# EAGLE schematic FamicomBox+ (EAGLE 9.6.2)
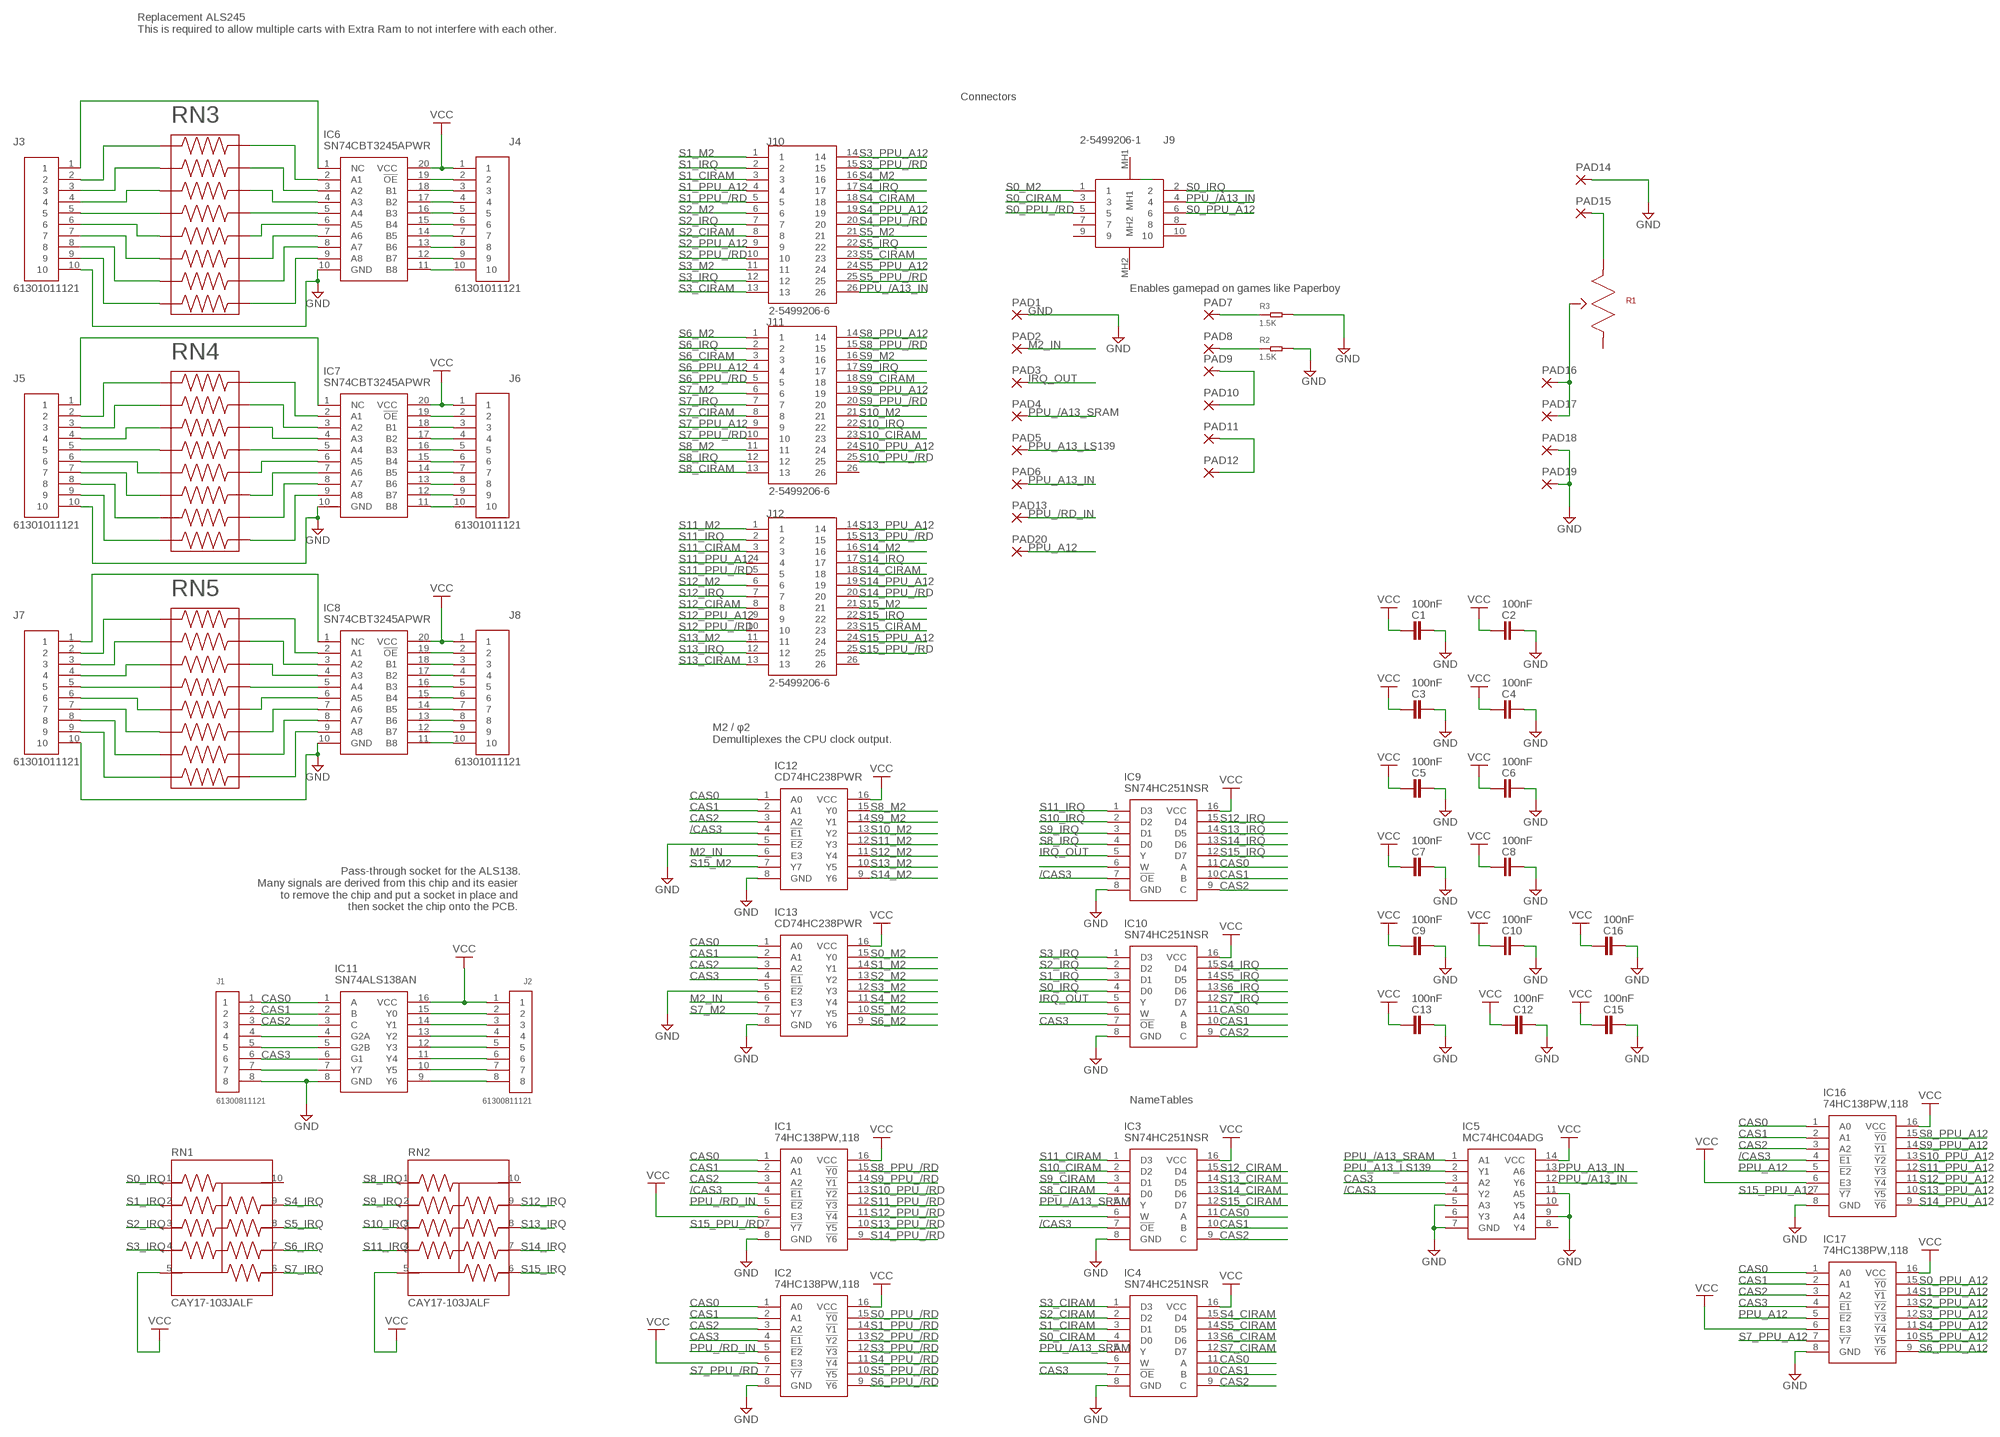
[diagram p0: schematic, sheet 1]

## Parts
C1  100nF  C_CHIP-0603(1608-METRIC)  [CAPC1608X85]
C2  100nF  C_CHIP-0603(1608-METRIC)  [CAPC1608X85]
C3  100nF  C_CHIP-0603(1608-METRIC)  [CAPC1608X85]
C4  100nF  C_CHIP-0603(1608-METRIC)  [CAPC1608X85]
C5  100nF  C_CHIP-0603(1608-METRIC)  [CAPC1608X85]
C6  100nF  C_CHIP-0603(1608-METRIC)  [CAPC1608X85]
C7  100nF  C_CHIP-0603(1608-METRIC)  [CAPC1608X85]
C8  100nF  C_CHIP-0603(1608-METRIC)  [CAPC1608X85]
C9  100nF  C_CHIP-0603(1608-METRIC)  [CAPC1608X85]
C10  100nF  C_CHIP-0603(1608-METRIC)  [CAPC1608X85]
C12  100nF  C_CHIP-0603(1608-METRIC)  [CAPC1608X85]
C13  100nF  C_CHIP-0603(1608-METRIC)  [CAPC1608X85]
C15  100nF  C_CHIP-0603(1608-METRIC)  [CAPC1608X85]
C16  100nF  C_CHIP-0603(1608-METRIC)  [CAPC1608X85]
IC1  74HC138PW,118  [SOP65P640X110-16N]
IC2  74HC138PW,118  [SOP65P640X110-16N]
IC3  SN74HC251NSR  [SOIC127P780X200-16N]
IC4  SN74HC251NSR  [SOIC127P780X200-16N]
IC5  MC74HC04ADG  [SOIC127P600X175-14N]
IC6  SN74CBT3245APWR  [SOP65P640X120-20N]
IC7  SN74CBT3245APWR  [SOP65P640X120-20N]
IC8  SN74CBT3245APWR  [SOP65P640X120-20N]
IC9  SN74HC251NSR  [SOIC127P780X200-16N]
IC10  SN74HC251NSR  [SOIC127P780X200-16N]
IC11  SN74ALS138AN  [DIP254P762X508-16]
IC12  CD74HC238PWR  [SOP65P640X120-16N]
IC13  CD74HC238PWR  [SOP65P640X120-16N]
IC16  74HC138PW,118  [SOP65P640X110-16N]
IC17  74HC138PW,118  [SOP65P640X110-16N]
J1  61300811121  [61300811121]
J2  61300811121  [61300811121]
J3  61301011121  [61301011121]
J4  61301011121  [61301011121]
J5  61301011121  [61301011121]
J6  61301011121  [61301011121]
J7  61301011121  [61301011121]
J8  61301011121  [61301011121]
J9  2-5499206-1  [254992061]
J10  2-5499206-6  [TE_2-5499206-6]
J11  2-5499206-6  [TE_2-5499206-6]
J12  2-5499206-6  [TE_2-5499206-6]
PAD1  WIREPAD2,54/1,0  [2,54/1,0]
PAD2  WIREPAD2,54/1,0  [2,54/1,0]
PAD3  WIREPAD2,54/1,0  [2,54/1,0]
PAD4  WIREPAD2,54/1,0  [2,54/1,0]
PAD5  WIREPAD2,54/1,0  [2,54/1,0]
PAD6  WIREPAD2,54/1,0  [2,54/1,0]
PAD7  WIREPAD2,54/1,0  [2,54/1,0]
PAD8  WIREPAD2,54/1,0  [2,54/1,0]
PAD9  WIREPAD2,54/1,0  [2,54/1,0]
PAD10  WIREPAD2,54/1,0  [2,54/1,0]
PAD11  WIREPAD2,54/1,0  [2,54/1,0]
PAD12  WIREPAD2,54/1,0  [2,54/1,0]
PAD13  WIREPAD2,54/1,0  [2,54/1,0]
PAD14  WIREPAD2,54/1,0  [2,54/1,0]
PAD15  WIREPAD2,54/1,0  [2,54/1,0]
PAD16  WIREPAD2,54/1,0  [2,54/1,0]
PAD17  WIREPAD2,54/1,0  [2,54/1,0]
PAD18  WIREPAD2,54/1,0  [2,54/1,0]
PAD19  WIREPAD2,54/1,0  [2,54/1,0]
PAD20  WIREPAD2,54/1,0  [2,54/1,0]
R1  PTV09A-4020F-A504  [PTV09]
R2  1.5K  SMD-RES-1.2K-1%-1/10W(0603)  [R0603]
R3  1.5K  SMD-RES-1.2K-1%-1/10W(0603)  [R0603]
RN1  CAY17-103JALF  [RESCAXS64P320X160X60-10N]
RN2  CAY17-103JALF  [RESCAXS64P320X160X60-10N]
RN3  4816P-1-562LF  [SOIC127P762X240-16N]
RN4  4816P-1-562LF  [SOIC127P762X240-16N]
RN5  4816P-1-562LF  [SOIC127P762X240-16N]

## Nets
/CAS3: IC1.4(!E1) IC3.7(!OE) IC5.4(Y2) IC9.7(!OE) IC12.4(!E1) IC16.4(!E1)
CAS0: IC1.1(A0) IC2.1(A0) IC3.11(A) IC4.11(A) IC9.11(A) IC10.11(A) IC11.1(A) IC12.1(A0) IC13.1(A0) IC16.1(A0) IC17.1(A0) J1.1
CAS1: IC1.2(A1) IC2.2(A1) IC3.10(B) IC4.10(B) IC9.10(B) IC10.10(B) IC11.2(B) IC12.2(A1) IC13.2(A1) IC16.2(A1) IC17.2(A1) J1.2
CAS2: IC1.3(A2) IC2.3(A2) IC3.9(C) IC4.9(C) IC9.9(C) IC10.9(C) IC11.3(C) IC12.3(A2) IC13.3(A2) IC16.3(A2) IC17.3(A2) J1.3
CAS3: IC2.4(!E1) IC4.7(!OE) IC5.3(A2) IC10.7(!OE) IC11.6(G1) IC13.4(!E1) IC17.4(!E1) J1.6
GND: C1.1 C2.1 C3.1 C4.1 C5.1 C6.1 C7.1 C8.1 C9.1 C10.1 C12.1 C13.1 C15.1 C16.1 IC1.8(GND) IC2.8(GND) IC3.8(GND) IC4.8(GND) IC5.5(A3) IC5.7(GND) IC5.9(A4) IC5.11(A5) IC6.10(GND) IC7.10(GND) IC8.10(GND) IC9.8(GND) IC10.8(GND) IC11.8(GND) IC12.5(!E2) IC12.8(GND) IC13.5(!E2) IC13.8(GND) IC16.8(GND) IC17.8(GND) J1.8 J3.10 J5.10 J7.10 PAD1.1(P) PAD14.1(P) PAD18.1(P) PAD19.1(P) R2.2 R3.2
IRQ_OUT: IC9.5(Y) IC10.5(Y) PAD3.1(P)
M2_IN: IC12.6(E3) IC13.6(E3) PAD2.1(P)
N$1: IC6.2(A1) RN3.16
N$2: IC6.3(A2) RN3.15
N$3: IC6.4(A3) RN3.14
N$4: IC6.5(A4) RN3.13
N$5: IC6.6(A5) RN3.12
N$6: IC6.7(A6) RN3.11
N$7: IC6.8(A7) RN3.10
N$8: IC6.9(A8) RN3.9
N$9: J3.2 RN3.1
N$10: J3.3 RN3.2
N$11: IC6.11(B8) J4.10
N$12: IC6.12(B7) J4.9
N$13: IC6.13(B6) J4.8
N$14: IC6.14(B5) J4.7
N$15: IC6.15(B4) J4.6
N$16: IC6.16(B3) J4.5
N$17: IC6.17(B2) J4.4
N$18: IC6.18(B1) J4.3
N$19: IC6.19(!OE) J4.2
N$20: J3.4 RN3.3
N$21: J3.5 RN3.4
N$22: J3.6 RN3.5
N$23: J3.7 RN3.6
N$24: J3.8 RN3.7
N$25: J3.9 RN3.8
N$26: IC6.1(NC) J3.1
N$27: J7.2 RN5.1
N$29: IC7.11(B8) J6.10
N$30: IC7.12(B7) J6.9
N$31: IC7.13(B6) J6.8
N$32: IC7.14(B5) J6.7
N$33: IC7.15(B4) J6.6
N$34: IC7.16(B3) J6.5
N$35: IC7.17(B2) J6.4
N$36: IC7.18(B1) J6.3
N$37: IC7.19(!OE) J6.2
N$38: IC8.19(!OE) J8.2
N$39: IC8.18(B1) J8.3
N$40: IC8.17(B2) J8.4
N$41: IC8.16(B3) J8.5
N$42: IC8.15(B4) J8.6
N$43: IC8.14(B5) J8.7
N$44: IC8.13(B6) J8.8
N$45: IC8.12(B7) J8.9
N$46: IC8.11(B8) J8.10
N$47: IC7.5(A4) RN4.13
N$48: J5.5 RN4.4
N$49: J5.2 RN4.1
N$50: J5.3 RN4.2
N$51: J5.4 RN4.3
N$52: J5.6 RN4.5
N$53: J5.7 RN4.6
N$54: J5.8 RN4.7
N$55: J5.9 RN4.8
N$56: IC11.15(Y0) J2.2
N$57: IC11.14(Y1) J2.3
N$58: IC11.13(Y2) J2.4
N$59: IC11.12(Y3) J2.5
N$60: IC11.11(Y4) J2.6
N$61: IC11.10(Y5) J2.7
N$62: IC11.9(Y6) J2.8
N$63: IC11.4(G2A) J1.4
N$64: PAD9.1(P) PAD10.1(P)
N$65: PAD11.1(P) PAD12.1(P)
N$66: IC7.4(A3) RN4.14
N$67: IC11.5(G2B) J1.5
N$68: IC7.3(A2) RN4.15
N$69: IC11.7(Y7) J1.7
N$70: IC9.6(W)
N$71: IC7.2(A1) RN4.16
N$72: IC7.1(NC) J5.1
N$73: IC7.6(A5) RN4.12
N$74: IC7.7(A6) RN4.11
N$75: IC7.8(A7) RN4.10
N$76: IC7.9(A8) RN4.9
N$77: J7.3 RN5.2
N$78: J7.5 RN5.4
N$79: IC8.5(A4) RN5.13
N$80: IC8.4(A3) RN5.14
N$81: IC8.3(A2) RN5.15
N$82: IC8.2(A1) RN5.16
N$83: IC8.6(A5) RN5.12
N$84: IC8.7(A6) RN5.11
N$85: IC8.8(A7) RN5.10
N$86: IC10.6(W)
N$87: IC8.9(A8) RN5.9
N$88: IC8.1(NC) J7.1
N$89: J7.4 RN5.3
N$90: J7.6 RN5.5
N$91: J7.7 RN5.6
N$92: J7.8 RN5.7
N$93: J7.9 RN5.8
N$94: PAD15.1(P) R1.1
N$95: PAD16.1(P) PAD17.1(P) R1.2
N$96: PAD8.1(P) R2.1
N$97: PAD7.1(P) R3.1
N$108: IC3.6(W)
N$122: IC4.6(W)
PPU_/A13_IN: IC5.12(Y6) J9.4 J10.26
PPU_/A13_SRAM: IC3.5(Y) IC4.5(Y) IC5.1(A1) PAD4.1(P)
PPU_/RD_IN: IC1.5(!E2) IC2.5(!E2) PAD13.1(P)
PPU_A12: IC16.5(!E2) IC17.5(!E2) PAD20.1(P)
PPU_A13_IN: IC5.13(A6) PAD6.1(P)
PPU_A13_LS139: IC5.2(Y1) PAD5.1(P)
S0_CIRAM: IC4.4(D0) J9.3
S0_IRQ: IC10.4(D0) J9.2 RN1.1
S0_M2: IC13.15(Y0) J9.1
S0_PPU_/RD: IC2.15(!Y0) J9.5
S0_PPU_A12: IC17.15(!Y0) J9.6
S1_CIRAM: IC4.3(D1) J10.3
S1_IRQ: IC10.3(D1) J10.2 RN1.2
S1_M2: IC13.14(Y1) J10.1
S1_PPU_/RD: IC2.14(!Y1) J10.5
S1_PPU_A12: IC17.14(!Y1) J10.4
S2_CIRAM: IC4.2(D2) J10.8
S2_IRQ: IC10.2(D2) J10.7 RN1.3
S2_M2: IC13.13(Y2) J10.6
S2_PPU_/RD: IC2.13(!Y2) J10.10
S2_PPU_A12: IC17.13(!Y2) J10.9
S3_CIRAM: IC4.1(D3) J10.13
S3_IRQ: IC10.1(D3) J10.12 RN1.4
S3_M2: IC13.12(Y3) J10.11
S3_PPU_/RD: IC2.12(!Y3) J10.15
S3_PPU_A12: IC17.12(!Y3) J10.14
S4_CIRAM: IC4.15(D4) J10.18
S4_IRQ: IC10.15(D4) J10.17 RN1.9
S4_M2: IC13.11(Y4) J10.16
S4_PPU_/RD: IC2.11(!Y4) J10.20
S4_PPU_A12: IC17.11(!Y4) J10.19
S5_CIRAM: IC4.14(D5) J10.23
S5_IRQ: IC10.14(D5) J10.22 RN1.8
S5_M2: IC13.10(Y5) J10.21
S5_PPU_/RD: IC2.10(!Y5) J10.25
S5_PPU_A12: IC17.10(!Y5) J10.24
S6_CIRAM: IC4.13(D6) J11.3
S6_IRQ: IC10.13(D6) J11.2 RN1.7
S6_M2: IC13.9(Y6) J11.1
S6_PPU_/RD: IC2.9(!Y6) J11.5
S6_PPU_A12: IC17.9(!Y6) J11.4
S7_CIRAM: IC4.12(D7) J11.8
S7_IRQ: IC10.12(D7) J11.7 RN1.6
S7_M2: IC13.7(Y7) J11.6
S7_PPU_/RD: IC2.7(!Y7) J11.10
S7_PPU_A12: IC17.7(!Y7) J11.9
S8_CIRAM: IC3.4(D0) J11.13
S8_IRQ: IC9.4(D0) J11.12 RN2.1
S8_M2: IC12.15(Y0) J11.11
S8_PPU_/RD: IC1.15(!Y0) J11.15
S8_PPU_A12: IC16.15(!Y0) J11.14
S9_CIRAM: IC3.3(D1) J11.18
S9_IRQ: IC9.3(D1) J11.17 RN2.2
S9_M2: IC12.14(Y1) J11.16
S9_PPU_/RD: IC1.14(!Y1) J11.20
S9_PPU_A12: IC16.14(!Y1) J11.19
S10_CIRAM: IC3.2(D2) J11.23
S10_IRQ: IC9.2(D2) J11.22 RN2.3
S10_M2: IC12.13(Y2) J11.21
S10_PPU_/RD: IC1.13(!Y2) J11.25
S10_PPU_A12: IC16.13(!Y2) J11.24
S11_CIRAM: IC3.1(D3) J12.3
S11_IRQ: IC9.1(D3) J12.2 RN2.4
S11_M2: IC12.12(Y3) J12.1
S11_PPU_/RD: IC1.12(!Y3) J12.5
S11_PPU_A12: IC16.12(!Y3) J12.4
S12_CIRAM: IC3.15(D4) J12.8
S12_IRQ: IC9.15(D4) J12.7 RN2.9
S12_M2: IC12.11(Y4) J12.6
S12_PPU_/RD: IC1.11(!Y4) J12.10
S12_PPU_A12: IC16.11(!Y4) J12.9
S13_CIRAM: IC3.14(D5) J12.13
S13_IRQ: IC9.14(D5) J12.12 RN2.8
S13_M2: IC12.10(Y5) J12.11
S13_PPU_/RD: IC1.10(!Y5) J12.15
S13_PPU_A12: IC16.10(!Y5) J12.14
S14_CIRAM: IC3.13(D6) J12.18
S14_IRQ: IC9.13(D6) J12.17 RN2.7
S14_M2: IC12.9(Y6) J12.16
S14_PPU_/RD: IC1.9(!Y6) J12.20
S14_PPU_A12: IC16.9(!Y6) J12.19
S15_CIRAM: IC3.12(D7) J12.23
S15_IRQ: IC9.12(D7) J12.22 RN2.6
S15_M2: IC12.7(Y7) J12.21
S15_PPU_/RD: IC1.7(!Y7) J12.25
S15_PPU_A12: IC16.7(!Y7) J12.24
VCC: C1.2 C2.2 C3.2 C4.2 C5.2 C6.2 C7.2 C8.2 C9.2 C10.2 C12.2 C13.2 C15.2 C16.2 IC1.6(E3) IC1.16(VCC) IC2.6(E3) IC2.16(VCC) IC3.16(VCC) IC4.16(VCC) IC5.14(VCC) IC6.20(VCC) IC7.20(VCC) IC8.20(VCC) IC9.16(VCC) IC10.16(VCC) IC11.16(VCC) IC12.16(VCC) IC13.16(VCC) IC16.6(E3) IC16.16(VCC) IC17.6(E3) IC17.16(VCC) J2.1 J4.1 J6.1 J8.1 RN1.5 RN2.5
Unconnected: IC5.6(Y3) IC5.8(Y4) IC5.10(Y5) J9.7 J9.8 J9.9 J9.10 J9.MH1 J9.MH2 J11.26 J12.26 R1.3 RN1.10 RN2.10

## Notes on the sheet
- Replacement ALS245
  This is required to allow multiple carts with Extra Ram to not interfere with each other.
- Connectors
- Enables gamepad on games like Paperboy
- M2 / φ2
  Demultiplexes the CPU clock output.
- Pass-through socket for the ALS138.
  Many signals are derived from this chip and its easier 
  to remove the chip and put a socket in place and 
  then socket the chip onto the PCB.
- NameTables

## Library data of the parts
C1-C10 C12 C13 C15 C16 = Capacitor:C: Capacitor - Generic; CATEGORY: Capacitor
IC1 IC2 IC16 IC17 = 74HC138PW_118:74HC138PW,118: 74HC(T)138 - 3-to-8 line decoder/demultiplexer; inverting@en-us Source: Datasheet <https://assets.nexperia.com/documents/data-sheet/74HC_HCT138.pdf>; ARROW_PART_NUMBER: 74HC138PW,118; ARROW_PRICE-STOCK: https://www.arrow.com/en/products/74hc138pw118/nexperia; DESCRIPTION: 74HC(T)138 - 3-to-8 line decoder/demultiplexer; inverting@en-us; HEIGHT: 1.1mm; MANUFACTURER_NAME: Nexperia; MANUFACTURER_PART_NUMBER: 74HC138PW,118; MOUSER_PART_NUMBER: 771-74HC138PW-T; MOUSER_PRICE-STOCK: https://www.mouser.co.uk/ProductDetail/Nexperia/74HC138PW118?qs=P62ublwmbi97Yb8SK4wHOw%3D%3D
IC3 IC4 IC9 IC10 = SN74HC251NSR:SN74HC251NSR: Data Selectors/Multiplexers With 3-State Outputs Source: Datasheet <http://www.ti.com/lit/gpn/sn74hc251>; ARROW_PART_NUMBER: SN74HC251NSR; ARROW_PRICE-STOCK: https://www.arrow.com/en/products/sn74hc251nsr/texas-instruments; DESCRIPTION: Data Selectors/Multiplexers With 3-State Outputs; HEIGHT: 2mm; MANUFACTURER_NAME: Texas Instruments; MANUFACTURER_PART_NUMBER: SN74HC251NSR; MOUSER_PART_NUMBER: 595-SN74HC251NSR; MOUSER_PRICE-STOCK: https://www.mouser.co.uk/ProductDetail/Texas-Instruments/SN74HC251NSR?qs=3FVjRv9mUZ%252BV3BPq6pq0uQ%3D%3D
IC5 = MC74HC04ADG:MC74HC04ADG: ON SEMICONDUCTOR - MC74HC04ADG - IC, 74HC CMOS, SMD, 74HC04, SOIC14 Source: Datasheet <https://www.onsemi.com/pub/Collateral/MC74HC04A-D.PDF>; ARROW_PART_NUMBER: MC74HC04ADG; ARROW_PRICE-STOCK: https://www.arrow.com/en/products/mc74hc04adg/on-semiconductor; DESCRIPTION: ON SEMICONDUCTOR - MC74HC04ADG - IC, 74HC CMOS, SMD, 74HC04, SOIC14; HEIGHT: 1.75mm; MANUFACTURER_NAME: ON Semiconductor; MANUFACTURER_PART_NUMBER: MC74HC04ADG; MOUSER_PART_NUMBER: 863-MC74HC04ADG; MOUSER_PRICE-STOCK: https://www.mouser.co.uk/ProductDetail/ON-Semiconductor/MC74HC04ADG?qs=qg33o%252B8vzFrk%2Fs2XGCpy6A%3D%3D
IC6-IC8 = SN74CBT3245APWR:SN74CBT3245APWR: OCTAL BUS TRANSCEIVER WITH 3-STATE OUTPUTS Source: Datasheet <http://www.ti.com/lit/gpn/sn74cbt3245a>; ARROW_PART_NUMBER: SN74CBT3245APWR; ARROW_PRICE-STOCK: https://www.arrow.com/en/products/sn74cbt3245apwr/texas-instruments; DESCRIPTION: OCTAL BUS TRANSCEIVER WITH 3-STATE OUTPUTS; HEIGHT: 1.2mm; MANUFACTURER_NAME: Texas Instruments; MANUFACTURER_PART_NUMBER: SN74CBT3245APWR; MOUSER_PART_NUMBER: 595-SN74CBT3245APWR; MOUSER_PRICE-STOCK: https://www.mouser.co.uk/ProductDetail/Texas-Instruments/SN74CBT3245APWR?qs=NLW4NjXEBS5%252BHHdzA6a5Rg%3D%3D
IC11 = SN74ALS138AN:SN74ALS138AN: 3-Line to 8-Line Decoders/Demultiplexers Source: Datasheet <http://www.ti.com/lit/gpn/sn74als138a>; ARROW_PART_NUMBER: SN74ALS138AN; ARROW_PRICE-STOCK: https://www.arrow.com/en/products/sn74als138an/texas-instruments; DESCRIPTION: 3-Line to 8-Line Decoders/Demultiplexers; HEIGHT: mm; MANUFACTURER_NAME: Texas Instruments; MANUFACTURER_PART_NUMBER: SN74ALS138AN; MOUSER_PART_NUMBER: 595-SN74ALS138AN; MOUSER_PRICE-STOCK: https://www.mouser.co.uk/ProductDetail/Texas-Instruments/SN74ALS138AN?qs=tJ5HNKWh3OWp0jMuiORIJQ%3D%3D
IC12 IC13 = CD74HC238PWR:CD74HC238PWR: Texas Instruments CD74HC238PWR, Decoder, Demultiplexer, 1-of-8, Non-Inverting, 2 6 V, 16-Pin TSSOP Source: Datasheet <http://www.ti.com/lit/gpn/cd74hc238>; ARROW_PART_NUMBER: CD74HC238PWR; ARROW_PRICE-STOCK: https://www.arrow.com/en/products/cd74hc238pwr/texas-instruments; DESCRIPTION: Texas Instruments CD74HC238PWR, Decoder, Demultiplexer, 1-of-8, Non-Inverting, 2 6 V, 16-Pin TSSOP; HEIGHT: 1.2mm; MANUFACTURER_NAME: Texas Instruments; MANUFACTURER_PART_NUMBER: CD74HC238PWR; MOUSER_PART_NUMBER: 595-CD74HC238PWR; MOUSER_PRICE-STOCK: https://www.mouser.co.uk/ProductDetail/Texas-Instruments/CD74HC238PWR?qs=p6YqzpSxLIxxe92%252Bdbvp%252Bg%3D%3D
J1 J2 = Headers:61300811121: CONN HEADER VERT 8POS 2.54MM Manufacturer's datasheet <https://katalog.we-online.de/em/datasheet/6130xx11121.pdf>; CREATED_BY: PCBLayout.com; DIGI_KEY_PART_NUMBER: 732-5321-ND; MANUFACTURER: Wurth Electronics Inc.; MPN: 61300811121
J3-J8 = Headers:61301011121: CONN HEADER VERT 10POS 2.54MM Manufacturer's datasheet <https://katalog.we-online.de/em/datasheet/6130xx11121.pdf>; CREATED_BY: PCBLayout.com; DIGIKEY_PART_NUMBER: 732-2670-ND; MANUFACTURER: Wurth Electronics Inc.; MPN: 61301011121
J9 = 2-5499206-1:2-5499206-1: 10 way male straight side latch header Source: Datasheet <https://www.te.com/commerce/DocumentDelivery/DDEController?Action=showdoc&DocId=Customer Drawing5499206E1pdfEnglishENG_CD_5499206_E1.pdf2-5499206-1>; ARROW_PART_NUMBER: 2-5499206-1; ARROW_PRICE-STOCK: https://www.arrow.com/en/products/2-5499206-1/te-connectivity; DESCRIPTION: 10 way male straight side latch header; HEIGHT: 27.81mm; MANUFACTURER_NAME: TE Connectivity; MANUFACTURER_PART_NUMBER: 2-5499206-1; MOUSER_PART_NUMBER: 571-2-5499206-1; MOUSER_PRICE-STOCK: https://www.mouser.co.uk/ProductDetail/TE-Connectivity/2-5499206-1?qs=0WAkd%2F2UZ9TyW1Tlji91VQ%3D%3D
J10-J12 = 2-5499206-6:2-5499206-6: A/L UNIV HDR 26P VERT LG LAT BLUE Check prices <https://pricing.snapeda.com/parts/2-5499206-6/TE%20Connectivity/view-part?ref=eda>; AVAILABILITY: In Stock; CENTERLINE_PITCH: 2.54 mm[.1 in]; COMMENT: 2-5499206-6; DESCRIPTION: Conn Ejector Header HDR 26 POS 2.54mm Solder ST Thru-Hole; EU_ROHS_COMPLIANCE: Compliant; MF: TE Connectivity; MP: 2-5499206-6; NUMBER_OF_POSITIONS: 26; PACKAGE: None; PRICE: None; PRODUCT_TYPE: Connector; PURCHASE-URL: https://pricing.snapeda.com/search/part/2-5499206-6/?ref=eda
PAD1-PAD20 = wirepad:WIREPAD: Wire PAD connect wire on PCB
R1 = PTV09A-4020F-A504:PTV09A-4020F-A504: 500k Ohm 1 Gang Logarithmic Through Hole, Snap In Potentiometer None 1 Turn Carbon 0.05W, 1/20W PC Pins, Board Locks Check prices <https://pricing.snapeda.com/parts/PTV09A-4020F-A504/Bourns/view-part?ref=eda>; AVAILABILITY: In Stock; DESCRIPTION: 500k Ohm 1 Gang Logarithmic Through Hole, Snap In Potentiometer None 1 Kierros Carbon 0.05W, 1/20W PC Pins, Board Locks; MF: Bourns; MP: PTV09A-4020F-A504; PACKAGE: None; PRICE: None; PURCHASE-URL: https://pricing.snapeda.com/search/part/PTV09A-4020F-A504/?ref=eda
R2 R3 = OPL_Resistor:SMD-RES-1.2K-1%-1/10W(0603): 301012041; MPN: RC0603FR-071K5L
RN1 RN2 = CAY17-103JALF:CAY17-103JALF: Check prices <https://pricing.snapeda.com/parts/CAY17-103JALF/Bourns/view-part?ref=eda>; AVAILABILITY: In Stock; DESCRIPTION: 10k Ohm ±5% 62.5mW Power Per Element Bussed 8 Resistor Network/Array ±250ppm/°C 1206 (3216 Metric), Convex, Long Side Terminals; MF: Bourns; MP: CAY17-103JALF; PACKAGE: 1206 Bourns; PRICE: None; PURCHASE-URL: https://pricing.snapeda.com/search/part/CAY17-103JALF/?ref=eda
RN3-RN5 = 4816P-1-562LF:4816P-1-562LF: Res Thick Film NET 68K Ohm 2% 1.28W ±100ppm/C ISOL Molded 16-Pin SOM Gull Wing SMD Automotive T/R Check prices <https://pricing.snapeda.com/parts/4816P-1-562LF/Bourns/view-part?ref=eda>; AVAILABILITY: In Stock; DESCRIPTION: 5.6k Ohm ±2% 160mW Power Per Element Isolated 8 Resistor Network/Array ±100ppm/°C 16-SOIC (0.220, 5.59mm Width); MF: Bourns; MP: 4816P-1-562LF; PACKAGE: SOIC-16 Bourns; PRICE: None; PURCHASE-URL: https://pricing.snapeda.com/search/part/4816P-1-562LF/?ref=eda